# EAGLE design Breakout U.V. v.1.0 (EAGLE 9.4.2)
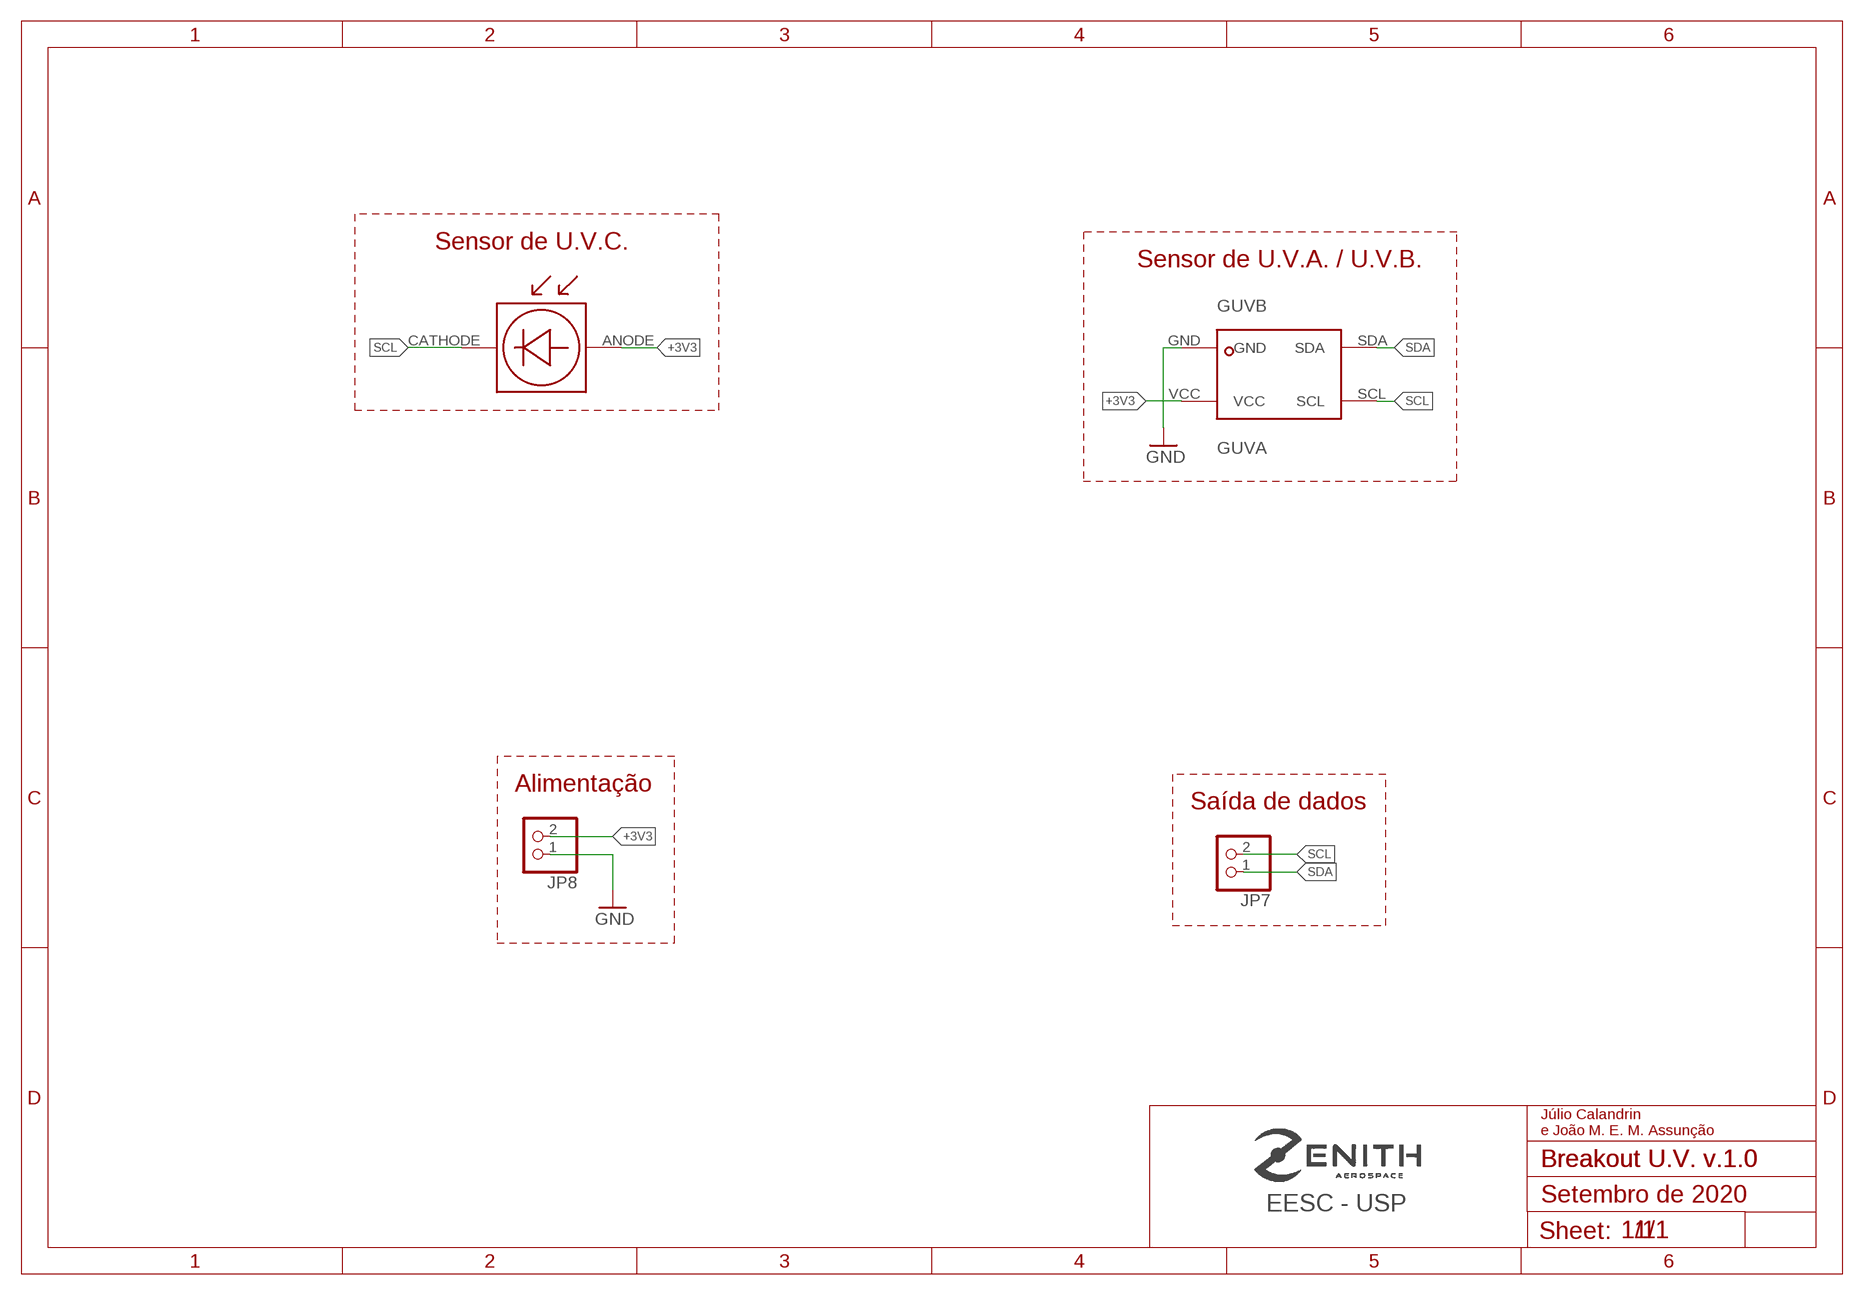
[diagram p0: schematic, sheet 1]

## Parts
GUVB  GUVA  GUVA-C32SM  [GUV_A/B]
JP7  PINHD-1X2  [1X02(PAD_REDUZIDO)]
JP8  PINHD-1X2  [1X02(PAD_REDUZIDO)]
U$1  GUVC-S10GD  [GUV_C]

## Nets
+3V3: GUVB.VCC JP8.2 U$1.ANODE
GND: GUVB.GND JP8.1
SCL: GUVB.SCL JP7.2 U$1.CATHODE
SDA: GUVB.SDA JP7.1

## Notes on the sheet
- Sensor de U.V.C.
- Sensor de U.V.A. / U.V.B.
- Alimentação
- Saída de dados
- Júlio Calandrin 
  e João M. E. M. Assunção
- Breakout U.V. v.1.0
- EESC - USP | Setembro de 2020
- 1/1

## Library data of the parts
GUVB = GUVX:GUVA-C32SM
JP7 JP8 = pinhead(1x3):PINHD-1X2: PIN HEADER
U$1 = GUVX:GUVC-S10GD

## Board
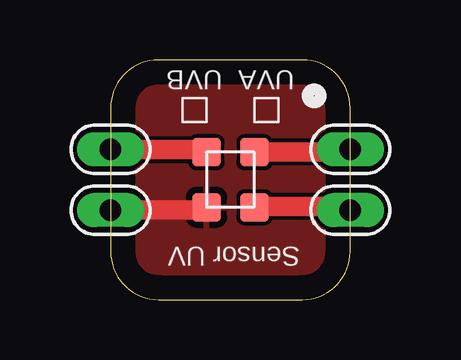
[diagram p1: board, top side]
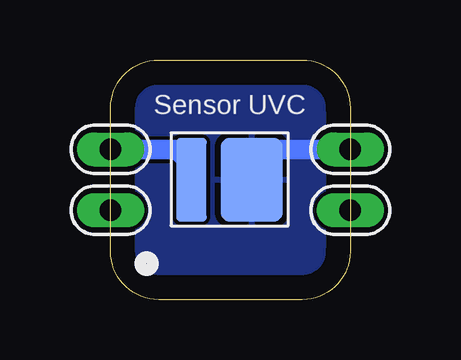
[diagram p2: board, bottom side, seen from below]

Size 10 x 10 mm. Coordinates in mm from the lower left corner, seen from the top.
Outline: 0,8 0,2 arc90 2,0 8,0 arc90 10,2 10,8 arc90 8,10 2,10 arc90 0,8
Copper layers (1*16): Top 0.035mm / dielectric 1.5mm / Bottom 0.035mm
Design rules "default": minimum track width 6mil, minimum drill 0.35mm, track to track 6mil, track to pad 6mil, pad to pad 6mil, via to via 6mil, smd to smd 6mil, copper to edge 40mil, drill to drill 6mil, minimum pad ring 10mil, minimum via ring 8mil, stop-mask expansion 4mil, vias tented up to drill 0mil, thermal gap 10mil

### Footprints (pad centres in the part's own frame; a part is rotated, then mirrored left to right if it is on the bottom)
GUV_A/B = smd 1.2 x 1.2: GND 1,1.15; SCL -1,-1.15; SDA -1,1.15; VCC 1,-1.15
1X02(PAD_REDUZIDO) = drill 0.9 pad 1.2 long: 1 -1.27,0; 2 1.27,0
GUV_C = smd 2.576 x 3.5: ANODE 0.888,0 | smd 1.276 x 3.5: CATHODE -1.629,0

### Placement (x,y rotation side)
GUVB  5,5 180 top
JP7  10,5 90 top
JP8  0,5 90 top
U$1  5,5 0 bottom

### Tracks (layer width: path | path; a pad name or v marks a point on that pad's centre or on a via)
+3V3
  Top 0.813: JP8.2 3.88,6.27 GUVB.VCC
  Bottom 0.813: U$1.ANODE 4.11,5.16 3,6.27 JP8.2
  pour Bottom: -1,11 -1,-1 11,-1 11,11
GND
  Top 0.813: JP8.1 3.88,3.73 GUVB.GND
  pour Top: -1,11 -1,-1 11,-1 11,11
SCL
  Top 0.813: JP7.2 9.88,6.15 GUVB.SCL
  Bottom 0.813: JP7.2 7.27,6.27 6.5,5.5 6.5,5.13 U$1.CATHODE
SDA
  Top 0.813: GUVB.SDA 6.03,3.88 9.85,3.88 JP7.1

### Text on the board
tNames: UVB | UVA | Sensor UV
bNames: Sensor UVC